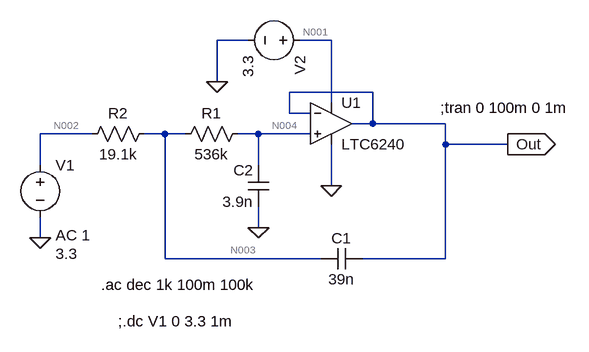
[diagram p0: schematic Circuit.asc]
* Circuit.asc
C1 Out N003 39n
R1 N004 N003 536k
R2 N003 N002 19.1k
C2 0 N004 3.9n
V1 N002 0 3.3 AC 1
V2 N001 0 3.3
* U1: LTC6240 (symbol Opamps\LTC6240 not available, pins judged from their places): In+=N004 In-=Out V+=N001 V-=0 OUT=Out
.ac dec 1k 100m 100k
;tran 0 100m 0 1m
;.dc V1 0 3.3 1m
.backanno
.end

* Results of the author's LTspice run, read from the files saved beside the schematic
* Operating Point, zero values left out:
*   V(out) = 3.3 V
*   V(n003) = 3.3 V
*   V(n004) = 3.3 V
*   V(n002) = 3.3 V
*   V(n001) = 3.3 V
*   I(R2) = -3.961 pA
*   I(R1) = -3.961 pA
*   I(V2) = -1.205 mA
*   I(V1) = -3.961 pA
*   Ix(u1:1) = 3.961 pA
*   Ix(u1:2) = 3.961 pA
*   Ix(u1:3) = 1.205 mA
*   Ix(u1:4) = -1.205 mA
*   Ix(u1:5) = 10.31 pA
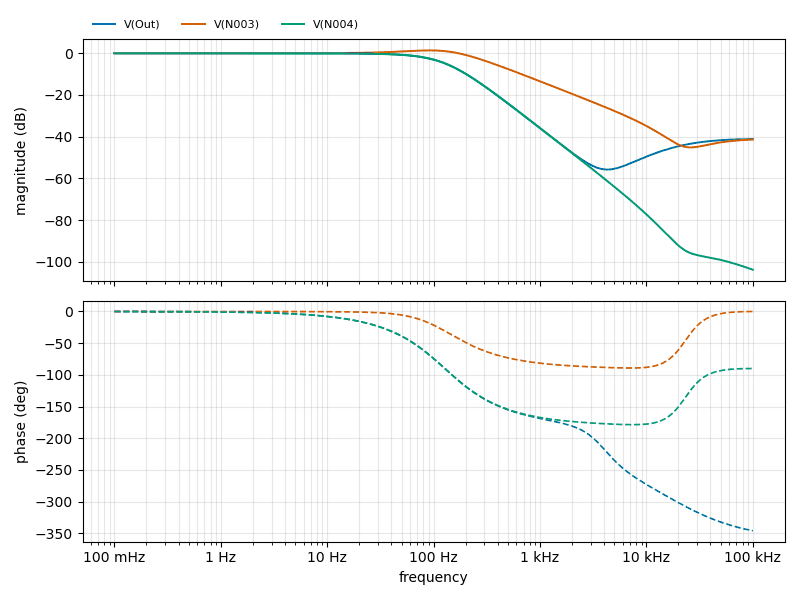
[diagram p1: AC Analysis of Circuit.asc, plotted from the saved traces]
* AC Analysis, 1 run:
*   V(Out): -0.08 dB at 100 mHz, -41.12 dB at 100 kHz, peak -0.08 dB at 100 mHz, 3 dB below the peak at 99.53 Hz
*   V(N003): 0.00 dB at 100 mHz, -41.38 dB at 100 kHz, peak 1.34 dB at 91.41 Hz, 3 dB below the peak at 229.2 Hz
*   V(N004): -0.00 dB at 100 mHz, -103.75 dB at 100 kHz, peak -0.00 dB at 100 mHz, 3 dB below the peak at 99.54 Hz